# Altium schematic sheet XMOS_chip.SchDoc
size Tabloid; DocumentNumber: 5; SheetNumber: 5; SheetTotal: 11; SheetName: XMOS processor; Size: 11x17; Sheet_Name: XMOS_chip
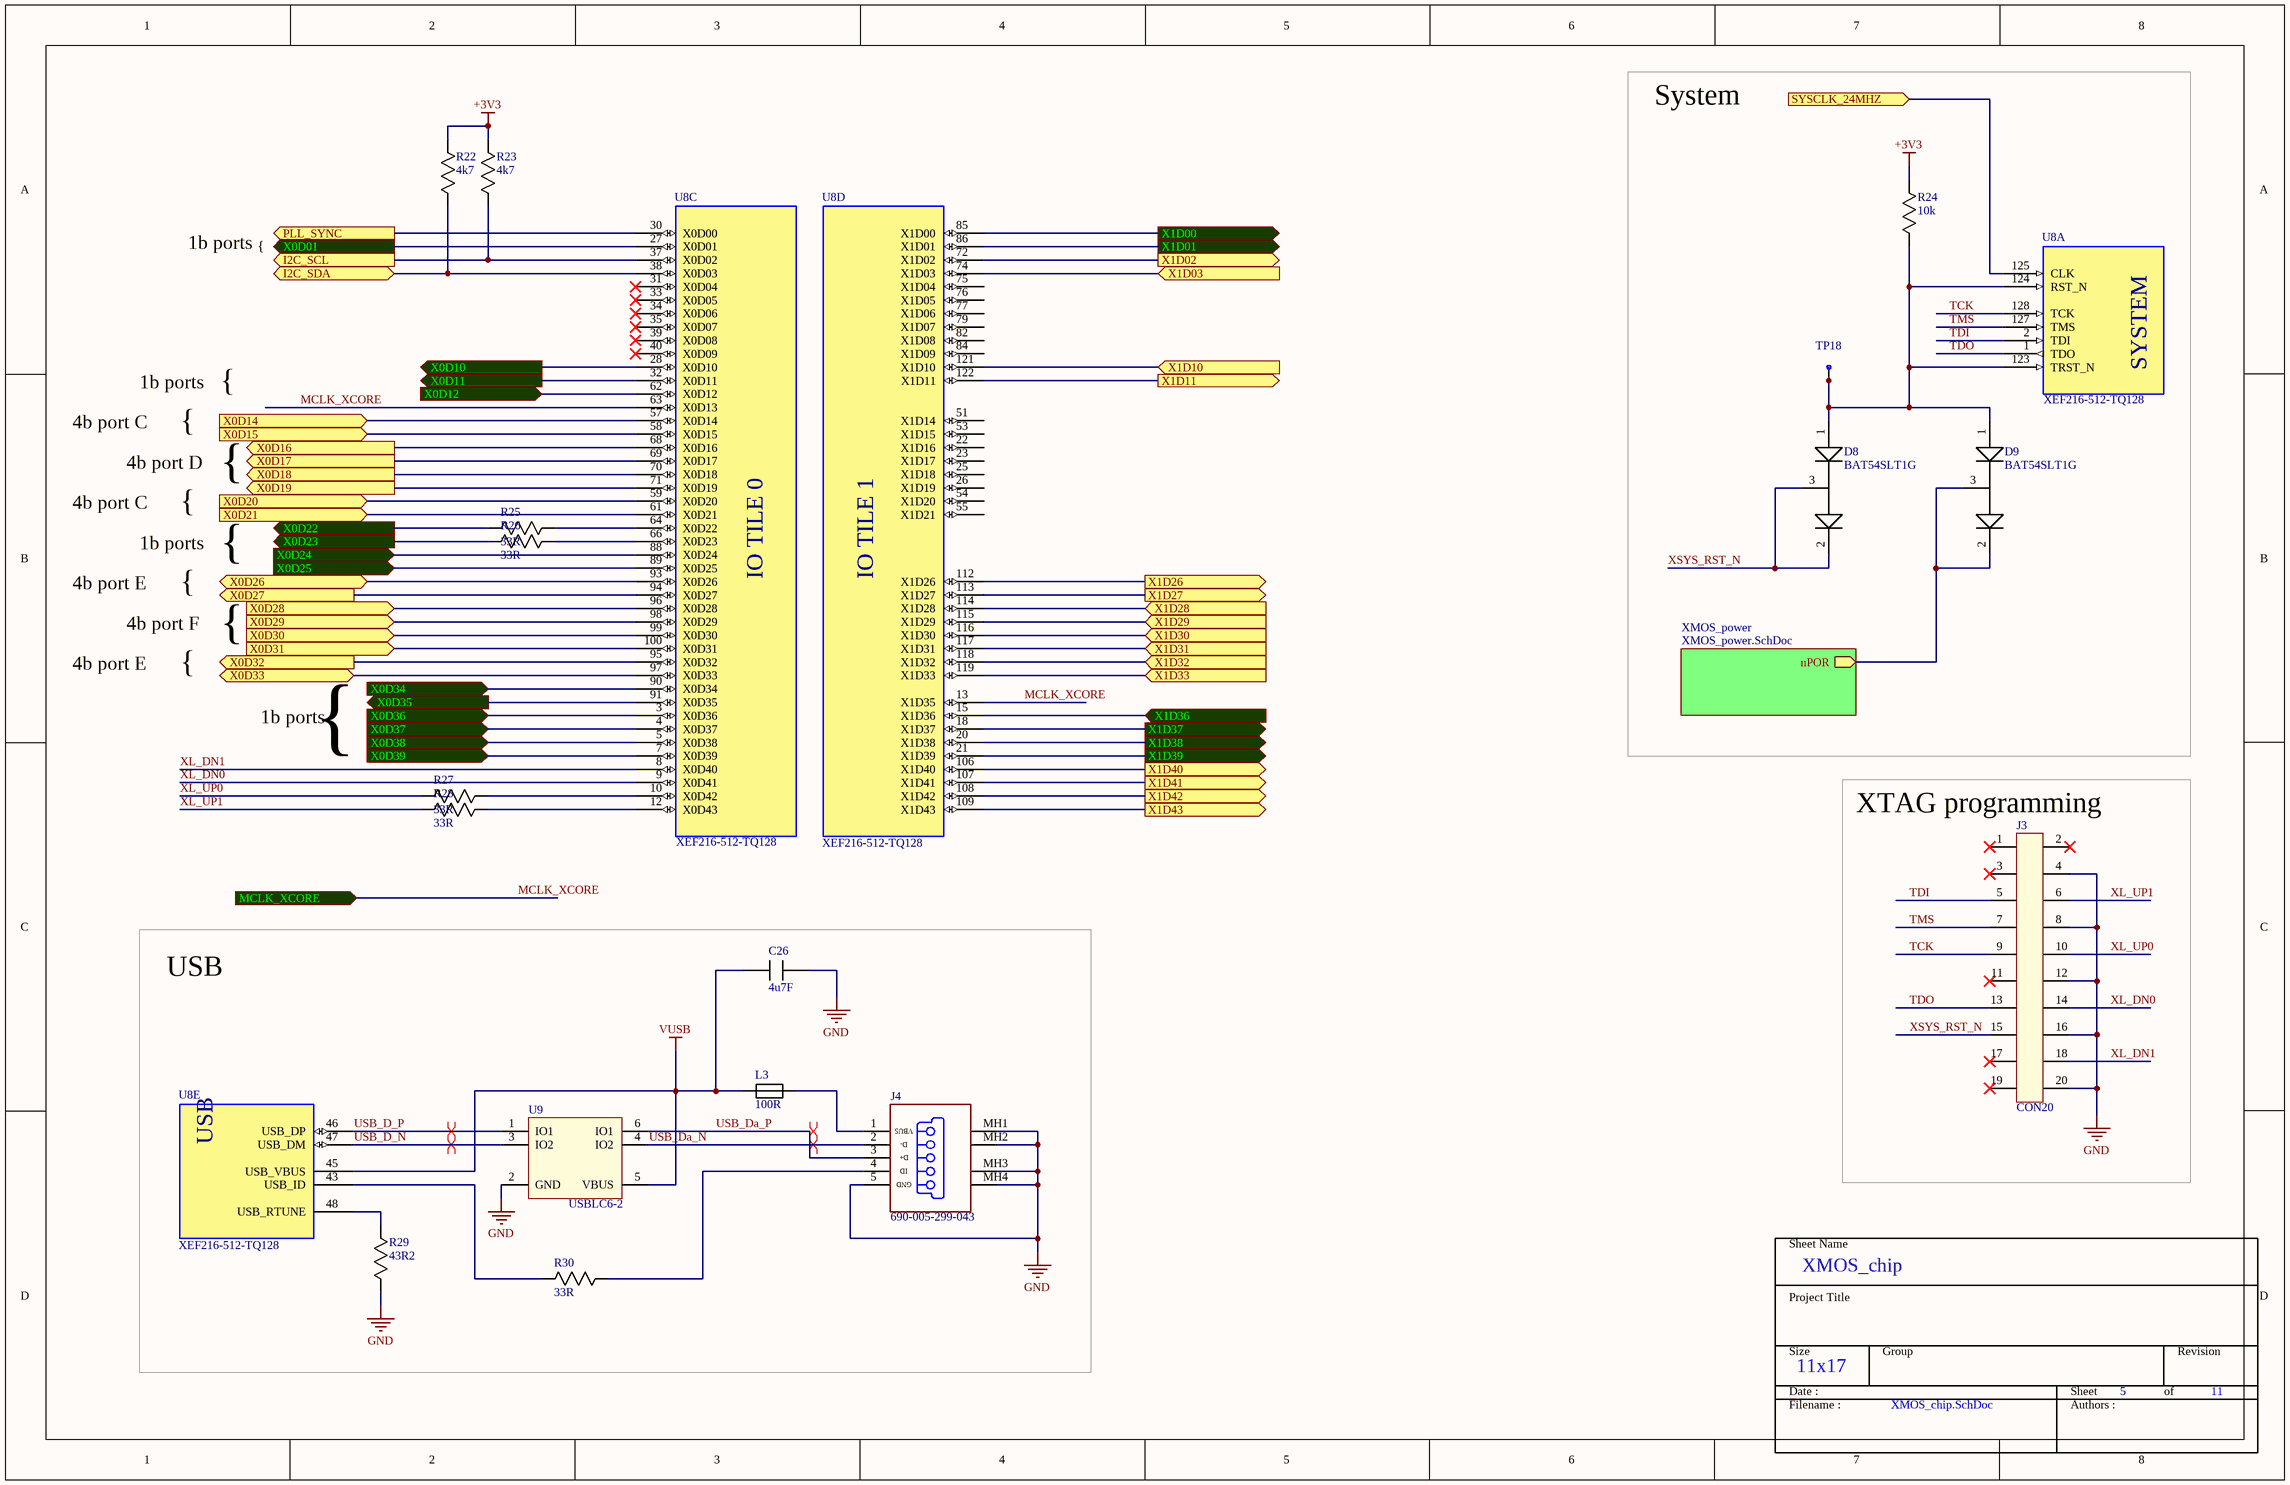
[diagram p0: XMOS_chip.SchDoc]

## Parts
C26  value 4u7F  [0603]  (hidden comment: Capacitor)
D8  Mfg_PN: BAT54SLT1G  [SOT23_132]  (hidden comment: Diode_dual)
D9  Mfg_PN: BAT54SLT1G  [SOT23_132]  (hidden comment: Diode_dual)
J3  CON20  [CONN20_100mils_pol_SMD]
J4  Mfg_PN: 690-005-299-043  [CONN_USB_MINIB_690-005-299-043]  (hidden comment: USB_MINIB_690-005-299-043)
L3  value 100R  [0805]  (hidden comment: Ferrite)
R22  value 4k7  [0603]  (hidden comment: Resistor)
R23  value 4k7  [0603]  (hidden comment: Resistor)
R24  value 10k  [0603]  (hidden comment: Resistor)
R25  value 33R  [0603]  (hidden comment: Resistor)
R26  value 33R  [0603]  (hidden comment: Resistor)
R27  value 33R  [0603]  (hidden comment: Resistor)
R28  value 33R  [0603]  (hidden comment: Resistor)
R29  value 43R2  [0603]  (hidden comment: Resistor)
R30  value 33R  [0603]  (hidden comment: Resistor)
TP18  TESTPOINT  [0603]  (value not drawn)
U8  Mfg_PN: XEF216-512-TQ128  [TQFP128_XMOS]  (parts A,C,D,E of 5)
U9  USBLC6-2  [USBLC6-2]

## Blocks framed on the sheet
System: D8 D9 R24 TP18 U8
XTAG programming: J3
USB: C26 J4 L3 R29 R30 U8 U9

## Sub-sheets
XMOS_power = XMOS_power.SchDoc: nPOR (out)

## Ports
I2C_SCL (out), I2C_SDA (bidir), MCLK_XCORE (in), PLL_SYNC (out), SYSCLK_24MHZ (in), X0D01 (out), X0D10 (out), X0D11 (out), X0D12 (in), X0D14 (in), X0D15 (in), X0D16 (out), X0D17 (out), X0D18 (out), X0D19 (out), X0D20 (in), X0D21 (in), X0D22 (out), X0D23 (out), X0D24 (in), X0D25 (in), X0D26 (bidir), X0D27 (out), X0D28 (in), X0D29 (in), X0D30 (in), X0D31 (in), X0D32 (out), X0D33 (bidir), X0D34 (in), X0D35 (out), X0D36 (in), X0D37 (in), X0D38 (in), X0D39 (in), X1D00 (out), X1D01 (out), X1D02 (out), X1D03 (in), X1D10 (in), X1D11 (out), X1D26 (out), X1D27 (out), X1D28 (in), X1D29 (in), X1D30 (in), X1D31 (in), X1D32 (in), X1D33 (in), X1D36 (in), X1D37 (out), X1D38 (out), X1D39 (out), X1D40 (out), X1D41 (out), X1D42 (out), X1D43 (out)

## Nets
+3V3: R22.1 R23.1 R24.1
GND: C26.2 J3.4 J3.8 J3.12 J3.16 J3.20 J4.5(GND) J4.MH1(Tab) J4.MH2(Tab) J4.MH3(Tab) J4.MH4(Tab) R29.1 U9.2(GND)
VUSB: C26.1 L3.1 U8.45(USB_VBUS) U9.5(VBUS)
I2C_SCL: R23.2 U8.37(X0D02) ; port I2C_SCL
I2C_SDA: R22.2 U8.38(X0D03) ; port I2C_SDA
MCLK_XCORE: U8.13(X1D35) U8.63(X0D13) ; port MCLK_XCORE
PLL_SYNC: U8.30(X0D00) ; port PLL_SYNC
SYSCLK_24MHZ: U8.125(CLK) ; port SYSCLK_24MHZ
TCK: J3.9 U8.128(TCK)
TDI: J3.5 U8.2(TDI)
TDO: J3.13 U8.1(TDO)
TMS: J3.7 U8.127(TMS)
USB_D_N: U8.47(USB_DM) U9.3(IO2)
USB_D_P: U8.46(USB_DP) U9.1(IO1)
USB_Da_N: J4.2(D-) U9.4(IO2)
USB_Da_P: J4.3(D+) U9.6(IO1)
X0D01: U8.27(X0D01) ; port X0D01
X0D10: U8.28(X0D10) ; port X0D10
X0D11: U8.32(X0D11) ; port X0D11
X0D12: U8.62(X0D12) ; port X0D12
X0D14: U8.57(X0D14) ; port X0D14
X0D15: U8.58(X0D15) ; port X0D15
X0D16: U8.68(X0D16) ; port X0D16
X0D17: U8.69(X0D17) ; port X0D17
X0D18: U8.70(X0D18) ; port X0D18
X0D19: U8.71(X0D19) ; port X0D19
X0D20: U8.59(X0D20) ; port X0D20
X0D21: U8.61(X0D21) ; port X0D21
X0D22: R25.1 ; port X0D22
X0D23: R26.1 ; port X0D23
X0D24: U8.88(X0D24) ; port X0D24
X0D25: U8.89(X0D25) ; port X0D25
X0D26: U8.93(X0D26) ; port X0D26
X0D27: U8.94(X0D27) ; port X0D27
X0D28: U8.96(X0D28) ; port X0D28
X0D29: U8.98(X0D29) ; port X0D29
X0D30: U8.99(X0D30) ; port X0D30
X0D31: U8.100(X0D31) ; port X0D31
X0D32: U8.95(X0D32) ; port X0D32
X0D33: U8.97(X0D33) ; port X0D33
X0D34: U8.90(X0D34) ; port X0D34
X0D35: U8.91(X0D35) ; port X0D35
X0D36: U8.3(X0D36) ; port X0D36
X0D37: U8.4(X0D37) ; port X0D37
X0D38: U8.5(X0D38) ; port X0D38
X0D39: U8.7(X0D39) ; port X0D39
X1D00: U8.85(X1D00) ; port X1D00
X1D01: U8.86(X1D01) ; port X1D01
X1D02: U8.72(X1D02) ; port X1D02
X1D03: U8.74(X1D03) ; port X1D03
X1D10: U8.121(X1D10) ; port X1D10
X1D11: U8.122(X1D11) ; port X1D11
X1D26: U8.112(X1D26) ; port X1D26
X1D27: U8.113(X1D27) ; port X1D27
X1D28: U8.114(X1D28) ; port X1D28
X1D29: U8.115(X1D29) ; port X1D29
X1D30: U8.116(X1D30) ; port X1D30
X1D31: U8.117(X1D31) ; port X1D31
X1D32: U8.118(X1D32) ; port X1D32
X1D33: U8.119(X1D33) ; port X1D33
X1D36: U8.15(X1D36) ; port X1D36
X1D37: U8.18(X1D37) ; port X1D37
X1D38: U8.20(X1D38) ; port X1D38
X1D39: U8.21(X1D39) ; port X1D39
X1D40: U8.106(X1D40) ; port X1D40
X1D41: U8.107(X1D41) ; port X1D41
X1D42: U8.108(X1D42) ; port X1D42
X1D43: U8.109(X1D43) ; port X1D43
XL_DN0: J3.14 U8.9(X0D41)
XL_DN1: J3.18 U8.8(X0D40)
XL_UP0: J3.10 R27.1
XL_UP1: J3.6 R28.1
XSYS_RST_N: D8.2(K) D8.3(AK) J3.15
NetD8_1: D8.1(K) D9.1(K) R24.2 TP18.1 TP18.2 U8.123(TRST_N) U8.124(RST_N)
NetD9_2: D9.2(K) D9.3(AK) ; sheet XMOS_power/nPOR
NetJ4_1: J4.1(V_BUS_(5V)) L3.2
NetJ4_4: J4.4(NC) R30.1
NetR25_2: R25.2 U8.64(X0D22)
NetR26_2: R26.2 U8.66(X0D23)
NetR27_2: R27.2 U8.10(X0D42)
NetR28_2: R28.2 U8.12(X0D43)
NetR29_2: R29.2 U8.48(USB_RTUNE)
NetR30_2: R30.2 U8.43(USB_ID)

Not connected (* = marked no-connect by the designer): J3 1* 2* 3* 11* 17* 19*; U8 22(X1D16) 23(X1D17) 25(X1D18) 26(X1D19) 31(X0D04)* 33(X0D05)* 34(X0D06)* 35(X0D07)* 39(X0D08)* 40(X0D09)* 51(X1D14) 53(X1D15) 54(X1D20) 55(X1D21) 75(X1D04) 76(X1D05) 77(X1D06) 79(X1D07) 82(X1D08) 84(X1D09)

## Layout directives
differential pair: USB_D_N, USB_D_P, USB_Da_N, USB_Da_P

## Notes on the sheet
- 1b ports
- {
- 4b port C
- 4b port D
- 4b port E
- 4b port F
- Sheet Name
- Project Title
- Size
- Group
- Revision
- Date :
- Filename :
- Sheet
- Authors :
- of
- (in symbol USB_MINIB_690-005-299-043) VBUS; ID
- (in symbol XMOS_XEF216-512-TQ128, part A) SYSTEM
- (in symbol XMOS_XEF216-512-TQ128, part C) IO TILE 0
- (in symbol XMOS_XEF216-512-TQ128, part D) IO TILE 1
- (in symbol XMOS_XEF216-512-TQ128, part E) USB

## Library data of the parts
C26 = Capacitor: Mfg: Samsung; Mfg_PN: CL21A475KAQNNNG; HelpURL: *; NI: *; Supplier1: Digikey; Supplier1_PN: 1276-6462-1-ND; Tolerance: *; Type: *; Rating: *
D8 D9 = Diode_dual: Diode; Mfg: Onsemi; HelpURL: *; NI: *; Supplier1: Digikey; Supplier1_PN: BAT54SLT1GOSCT-ND; Tolerance: *; Type: *; Rating: *; Value: *
J3 = CON20: 20-pins; Mfg: CNC Tech; Mfg_PN: 3020-20-0300-00; HelpURL: *; NI: *; Rating: *; Supplier1: Digikey; Supplier1_PN: 1175-1623-ND; Tolerance: *; Type: *; Value: *
J4 = USB_MINIB_690-005-299-043: USB On-The-Go (OTG) Mini-B Receptacle, Right Angle, SMT, 0.80mm (.031") Pitch, Solder Tabs with Back Cover, Recessed Type; Mfg: EDAC; Supplier1: Digikey; Supplier1_PN: 151-1206-1-ND
L3 = Ferrite: Mfg: Bourns; Mfg_PN: MH2029-101Y; Rating: 1A; HelpURL: *; NI: *; Supplier1: Digikey; Supplier1_PN: MH2029-101YCT-ND; Tolerance: *; Type: *
R22 R23 = Resistor: Mfg: Yageo; Mfg_PN: RC0603JR-074K7L; HelpURL: *; NI: *; Supplier1: Digikey; Supplier1_PN: 311-4.7KGRCT-ND; Type: *; Rating: *; Tolerance: *
R24 = Resistor: Mfg: Yageo; Mfg_PN: RC0603JR-0710KL; HelpURL: *; NI: *; Supplier1: Digikey; Supplier1_PN: 311-10KGRCT-ND; Type: *; Rating: *; Tolerance: *
R25-R28 R30 = Resistor: Mfg: Yageo; Mfg_PN: RC0603JR-0733RL; HelpURL: *; NI: *; Supplier1: Digikey; Supplier1_PN: 311-33GRCT-ND; Type: *; Rating: *; Tolerance: *
R29 = Resistor: Mfg: Yageo; Mfg_PN: RC0603FR-0743R2L; HelpURL: *; NI: *; Supplier1: Digikey; Supplier1_PN: 311-43.2HRCT-ND; Type: *; Rating: *; Tolerance: *
TP18 = TESTPOINT: Test point; Mfg: TE; Mfg_PN: RCU-0C; HelpURL: *; NI: *; Rating: *; Supplier1: Digikey; Supplier1_PN: A106145CT-ND; Tolerance: *; Type: *; Value: *
U8 = XMOS_XEF216-512-TQ128: 32-bit multicore microcontroller. 2 Tiles. 16 Logical Cores. 512KB SRAM. 1000MIPS. TQFP128.; Mfg: XMOS; Supplier1: Digikey; Supplier1_PN: 880-1100-ND
U9 = USBLC6-2: USB overvoltage protection; Mfg: ST; HelpURL: http://www.st.com/web/en/resource/technical/document/datasheet/CD00050750.pdf; Mfg_PN: USBLC6-2; NI: *; Supplier1: Digikey; Supplier1_PN: 497-5026-2-ND; Type: *